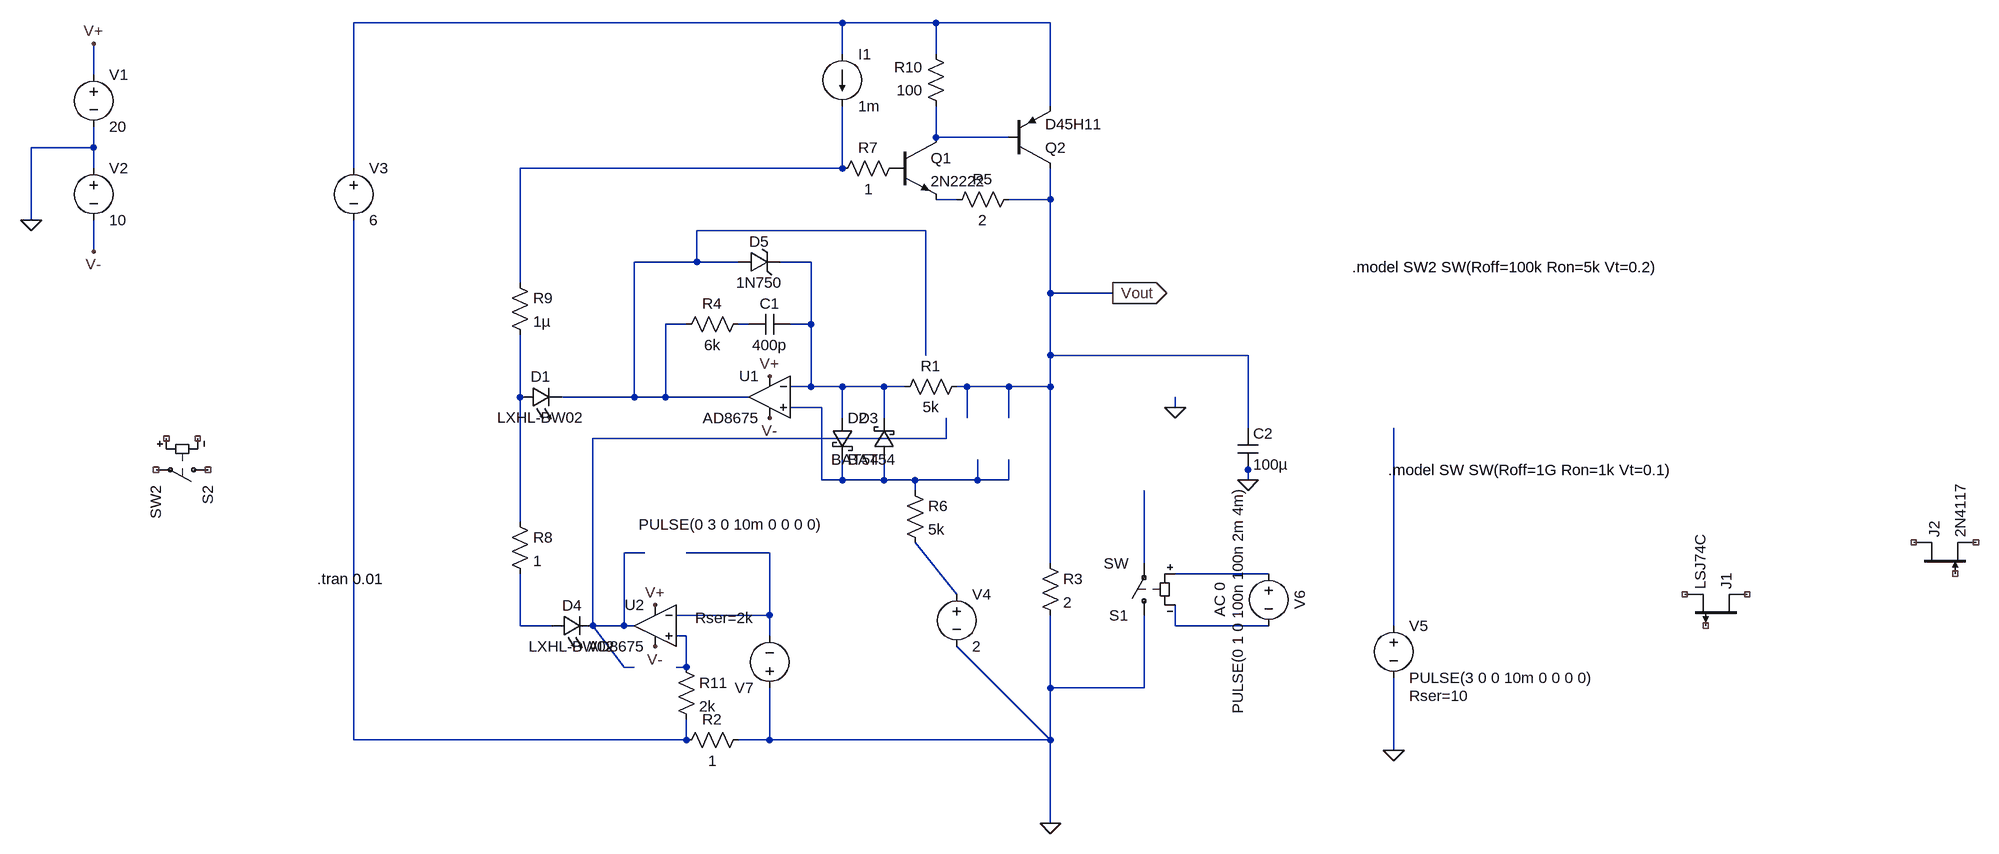
[diagram p0: schematic my_design_from_scratch_test_cv_cc_design_2.asc]
my_design_from_scratch_test_cv_cc_design_2.asc, the LTspice schematic file:
Version 4
SHEET 1 2008 1284
WIRE 256 32 -496 32
WIRE 400 32 256 32
WIRE 576 32 400 32
WIRE 256 80 256 32
WIRE 400 80 400 32
WIRE -896 112 -896 64
WIRE 576 160 576 32
WIRE 400 208 400 160
WIRE 512 208 400 208
WIRE -896 224 -896 192
WIRE -896 224 -992 224
WIRE -896 256 -896 224
WIRE -496 256 -496 32
WIRE 256 256 256 160
WIRE 256 256 -240 256
WIRE 432 304 400 304
WIRE 576 304 576 256
WIRE 576 304 512 304
WIRE -992 336 -992 224
WIRE 384 352 32 352
WIRE -896 384 -896 336
WIRE 32 400 32 352
WIRE 32 400 -64 400
WIRE 96 400 32 400
WIRE 208 400 160 400
WIRE -240 432 -240 256
WIRE 576 448 576 304
WIRE 672 448 576 448
WIRE 16 496 -16 496
WIRE 112 496 96 496
WIRE 208 496 208 400
WIRE 208 496 176 496
WIRE 384 544 384 352
WIRE 576 544 576 448
WIRE 880 544 576 544
WIRE 208 592 208 496
WIRE 208 592 176 592
WIRE 256 592 208 592
WIRE 320 592 256 592
WIRE 352 592 320 592
WIRE 448 592 432 592
WIRE 512 592 448 592
WIRE 576 592 576 544
WIRE 576 592 512 592
WIRE -240 608 -240 512
WIRE -64 608 -64 400
WIRE -64 608 -176 608
WIRE -16 608 -16 496
WIRE -16 608 -64 608
WIRE 112 608 -16 608
WIRE 224 624 176 624
WIRE 768 624 768 608
WIRE 256 640 256 592
WIRE 320 640 320 592
WIRE 448 640 448 592
WIRE 512 640 512 592
WIRE 880 656 880 544
WIRE 416 672 416 640
WIRE 416 672 -128 672
WIRE 880 720 880 704
WIRE 224 736 224 624
WIRE 256 736 256 704
WIRE 256 736 224 736
WIRE 320 736 320 704
WIRE 320 736 256 736
WIRE 368 736 320 736
WIRE 464 736 464 704
WIRE 464 736 368 736
WIRE 512 736 512 704
WIRE 512 736 464 736
WIRE 880 736 880 720
WIRE 368 752 368 736
WIRE -240 800 -240 608
WIRE -48 848 -80 848
WIRE 144 848 16 848
WIRE 576 864 576 592
WIRE 720 864 720 752
WIRE 912 880 768 880
WIRE 432 912 368 832
WIRE 144 944 144 848
WIRE 144 944 0 944
WIRE -240 960 -240 880
WIRE -192 960 -240 960
WIRE -128 960 -128 672
WIRE -80 960 -80 848
WIRE -80 960 -128 960
WIRE -64 960 -80 960
WIRE 768 960 768 928
WIRE 912 960 768 960
WIRE 1104 960 1104 656
WIRE 16 976 0 976
WIRE 144 976 144 944
WIRE -80 1024 -128 960
WIRE -64 1024 -80 1024
WIRE 16 1024 16 976
WIRE 16 1024 0 1024
WIRE 576 1056 576 944
WIRE 720 1056 720 944
WIRE 720 1056 576 1056
WIRE -496 1136 -496 336
WIRE 16 1136 16 1104
WIRE 16 1136 -496 1136
WIRE 144 1136 144 1056
WIRE 144 1136 96 1136
WIRE 576 1136 432 992
WIRE 576 1136 576 1056
WIRE 576 1136 144 1136
WIRE 1104 1152 1104 1040
WIRE 576 1264 576 1136
FLAG -896 64 V+
FLAG -896 384 V-
FLAG 144 576 V+
FLAG 144 640 V-
FLAG 672 448 Vout
IOPIN 672 448 Out
FLAG 576 1264 0
FLAG -992 336 0
FLAG 880 736 0
FLAG 768 624 0
FLAG 1104 1152 0
FLAG -32 928 V+
FLAG -32 992 V-
SYMBOL voltage -896 96 R0
WINDOW 123 0 0 Left 0
WINDOW 39 0 0 Left 0
SYMATTR InstName V1
SYMATTR Value 20
SYMBOL voltage -896 240 R0
WINDOW 123 0 0 Left 0
WINDOW 39 0 0 Left 0
SYMATTR InstName V2
SYMATTR Value 10
SYMBOL voltage -496 240 R0
WINDOW 123 0 0 Left 0
WINDOW 39 0 0 Left 0
SYMATTR InstName V3
SYMATTR Value 6
SYMBOL res 112 1120 R90
WINDOW 0 0 56 VBottom 2
WINDOW 3 32 56 VTop 2
SYMATTR InstName R2
SYMATTR Value 1
SYMBOL Opamps\\AD8675 144 544 M0
SYMATTR InstName U1
SYMBOL voltage 432 896 R0
WINDOW 123 0 0 Left 0
WINDOW 39 0 0 Left 0
SYMATTR InstName V4
SYMATTR Value 2
SYMBOL cap 176 480 R90
WINDOW 0 0 32 VBottom 2
WINDOW 3 32 32 VTop 2
SYMATTR InstName C1
SYMATTR Value 400p
SYMBOL res 560 848 R0
SYMATTR InstName R3
SYMATTR Value 2
SYMBOL sw 720 960 R180
SYMATTR InstName S1
SYMBOL voltage 912 864 R0
WINDOW 0 32 56 VTop 2
WINDOW 3 -32 56 VBottom 2
WINDOW 123 -60 56 VBottom 2
WINDOW 39 0 0 Left 0
SYMATTR InstName V6
SYMATTR Value PULSE(0 1 0 100n 100n 2m 4m)
SYMATTR Value2 AC 0
SYMBOL cap 864 656 R0
SYMATTR InstName C2
SYMATTR Value 100µ
SYMBOL npn 336 208 R0
SYMATTR InstName Q1
SYMATTR Value 2N2222
SYMBOL current 256 80 R0
WINDOW 123 0 0 Left 0
WINDOW 39 0 0 Left 0
SYMATTR InstName I1
SYMATTR Value 1m
SYMBOL res 352 240 R90
WINDOW 0 0 56 VBottom 2
WINDOW 3 32 56 VTop 2
SYMATTR InstName R7
SYMATTR Value 1
SYMBOL res -256 416 R0
SYMATTR InstName R9
SYMATTR Value 1µ
SYMBOL zener 96 416 R270
WINDOW 0 32 32 VTop 2
WINDOW 3 0 32 VBottom 2
SYMATTR InstName D5
SYMATTR Value 1N750
SYMATTR Description Diode
SYMATTR Type diode
SYMBOL sw -704 720 R90
SYMATTR InstName S2
SYMATTR Value SW2
SYMBOL voltage 1104 944 R0
WINDOW 123 0 0 Left 0
WINDOW 39 24 124 Left 2
SYMATTR SpiceLine Rser=10
SYMATTR InstName V5
SYMATTR Value PULSE(3 0 0 10m 0 0 0 0)
SYMBOL res 448 576 R90
WINDOW 0 0 56 VBottom 2
WINDOW 3 32 56 VTop 2
SYMATTR InstName R1
SYMATTR Value 5k
SYMBOL res 112 480 R90
WINDOW 0 0 56 VBottom 2
WINDOW 3 32 56 VTop 2
SYMATTR InstName R4
SYMATTR Value 6k
SYMBOL res 352 736 R0
SYMATTR InstName R6
SYMATTR Value 5k
SYMBOL Opamps\\AD8675 -32 896 M0
SYMATTR InstName U2
SYMBOL LED -192 976 R270
WINDOW 0 32 32 VTop 2
WINDOW 3 0 32 VBottom 2
SYMATTR InstName D4
SYMATTR Value LXHL-BW02
SYMATTR Description Diode
SYMATTR Type diode
SYMBOL voltage 144 1072 R180
WINDOW 123 0 0 Left 0
WINDOW 39 24 124 Left 2
WINDOW 3 -82 268 Left 2
SYMATTR SpiceLine Rser=2k
SYMATTR InstName V7
SYMATTR Value PULSE(0 3 0 10m 0 0 0 0)
SYMBOL res -256 784 R0
SYMATTR InstName R8
SYMATTR Value 1
SYMBOL pnp2 512 256 M180
SYMATTR InstName Q2
SYMATTR Value D45H11
SYMBOL res 528 288 R90
WINDOW 0 0 56 VBottom 2
WINDOW 3 32 56 VTop 2
SYMATTR InstName R5
SYMATTR Value 2
SYMBOL res 416 176 R180
WINDOW 0 36 76 Left 2
WINDOW 3 36 40 Left 2
SYMATTR InstName R10
SYMATTR Value 100
SYMBOL res 0 1008 R0
SYMATTR InstName R11
SYMATTR Value 2k
SYMBOL LED -240 624 R270
WINDOW 0 32 32 VTop 2
WINDOW 3 0 32 VBottom 2
SYMATTR InstName D1
SYMATTR Value LXHL-BW02
SYMATTR Description Diode
SYMATTR Type diode
SYMBOL pjf 1648 960 M270
SYMATTR InstName J1
SYMATTR Value LSJ74C
SYMBOL njf 1904 880 R270
SYMATTR InstName J2
SYMATTR Value 2N4117
SYMBOL schottky 240 640 R0
SYMATTR InstName D2
SYMATTR Value BAT54
SYMATTR Description Diode
SYMATTR Type diode
SYMBOL schottky 336 704 R180
WINDOW 0 24 64 Left 2
WINDOW 3 24 0 Left 2
SYMATTR InstName D3
SYMATTR Value BAT54
SYMATTR Description Diode
SYMATTR Type diode
TEXT -552 888 Left 2 !.tran 0.01
TEXT 1096 720 Left 2 !.model SW SW(Roff=1G Ron=1k Vt=0.1)
TEXT 1040 408 Left 2 !.model SW2 SW(Roff=100k Ron=5k Vt=0.2)

The netlist it stands for:
* my_design_from_scratch_test_cv_cc_design_2.asc
V1 V+ 0 20
V2 0 V- 10
V3 N001 N019 6
R2 0 N019 1
XU1 N009 N006 V+ V- N005 AD8675  ; pins In+ In- V+ V- OUT
V4 N014 0 2
C1 N006 N007 400p
R3 Vout 0 2
S1 0 N012 N013 N016 SW
V6 N013 N016 PULSE(0 1 0 100n 100n 2m 4m) AC 0
C2 Vout 0 100µ
Q1 N002 P001 N004 0 2N2222
I1 N001 N003 1m
R7 P001 N003 1
R9 N003 N008 1µ
D5 N005 N006 1N750
S2 NC_01 NC_02 NC_03 NC_04 SW2
V5 N017 0 PULSE(3 0 0 10m 0 0 0 0) Rser=10
R1 Vout N006 5k
R4 N007 N005 6k
R6 N009 N014 5k
XU2 N018 N011 V+ V- N010 AD8675  ; pins In+ In- V+ V- OUT
D4 N015 N010 LXHL-BW02
V7 0 N011 PULSE(0 3 0 10m 0 0 0 0) Rser=2k
R8 N008 N015 1
Q2 Vout N002 N001 0 D45H11
R5 Vout N004 2
R10 N002 N001 100
R11 N018 N019 2k
D1 N008 N005 LXHL-BW02
J1 NC_05 NC_06 NC_07 LSJ74C
J2 NC_08 NC_09 NC_10 2N4117
D2 N006 N009 BAT54
D3 N009 N006 BAT54
.model D D
.lib standard.dio
.model NPN NPN
.model PNP PNP
.lib standard.bjt
.model NJF NJF
.model PJF PJF
.lib standard.jft
.tran 0.01
.model SW SW(Roff=1G Ron=1k Vt=0.1)
.model SW2 SW(Roff=100k Ron=5k Vt=0.2)
.backanno
.end